# Altium schematic sheet Mounts.SchDoc: NB3000XN Holes and Graphics
size A4; Organization: Altium Limited.; Address1: 3 Minna Close; Address2: Belrose; Address3: NSW 2085; Address4: AUSTRALIA; DocumentNumber: 19; Revision: 6; SheetNumber: 20; SheetTotal: 78
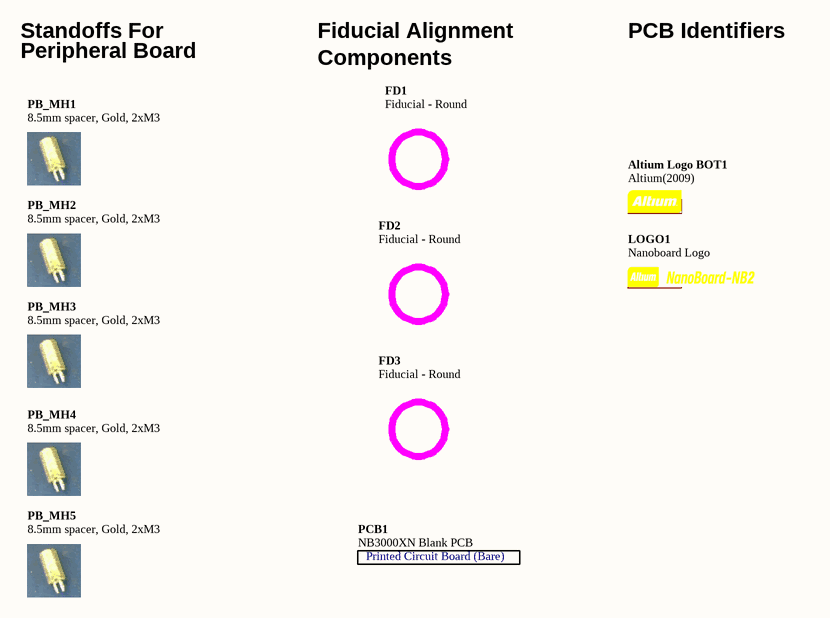
[diagram p0: Mounts.SchDoc]

## Parts
Altium_Logo_BOT1  Altium(2009)  [Logo-Altium-New]  (no BOM)
FD1  Fiducial - Round  [FIDUCIAL ROUND]  (no BOM)
FD2  Fiducial - Round  [FIDUCIAL ROUND]  (no BOM)
FD3  Fiducial - Round  [FIDUCIAL ROUND]  (no BOM)
LOGO1  Nanoboard Logo  [NANOBOARD LOGO]  (no BOM)
PB_MH1  8.5mm spacer, Gold, 2xM3  [STANDOFF_SOLDER_3MM]
PB_MH2  8.5mm spacer, Gold, 2xM3  [STANDOFF_SOLDER_3MM]
PB_MH3  8.5mm spacer, Gold, 2xM3  [STANDOFF_SOLDER_3MM]
PB_MH4  8.5mm spacer, Gold, 2xM3  [STANDOFF_SOLDER_3MM]
PB_MH5  8.5mm spacer, Gold, 2xM3  [STANDOFF_SOLDER_3MM]
PCB1  NB3000XN Blank PCB  [NB2STR01 Blank PCB]

## Nets
SHIELD: PB_MH1.STAND PB_MH2.STAND PB_MH3.STAND PB_MH4.STAND PB_MH5.STAND

## Notes on the sheet
- Peripheral Board
- Standoffs For
- Fiducial Alignment
- Components
- PCB Identifiers
- Sheet Title
- Project Title
- Size:
- Date:
- A4
- Assy:
- Time:
- Sheet
- Revision:
- of
- File:
- (in symbol D-810-0050) Printed Circuit Board (Bare)

## Library data of the parts
Altium_Logo_BOT1 = D-000-0003: Altium Logo for PCB; Category: Graphic-PCB; Status: Production
FD1-FD3 = D-004-0001: Fiducial - Round 1.5mm Top-Bottom; Status: Unreleased; Category: Fiducial
LOGO1 = D-000-0000: Status: Production; Category: Graphic-PCB
PB_MH1-PB_MH5 = D-306-0001: Spacer, 8.5mm GOLD, Splitted bottom, Female M3-thread; Category: Standoff; Status: Production
PCB1 = D-810-0050: NB3000XN Blank PCB - NanoBoard  3000 Series with Xilinx-3AN; ProjectPath: NB2STR01.PrjPCB; Status: Unreleased; Category: Blank PCB